# Altium schematic sheet MSP-EXP430F5529LP_3.SchDoc: MSP-EXP430F5529LP
size 286 x 199 mm; Date: 2015/6/22 13:08:34; SheetNumber: 4; Origin: Eagle; GateName_1: G$1; SymbolName_1: DINA4_L; LibraryName: MSP-EXP430F5659; DeviceSetName: DINA4_L; GateName_2: G$2; SymbolName_2: DOCFIELD; Sheet: Sheet:; REV: REV:
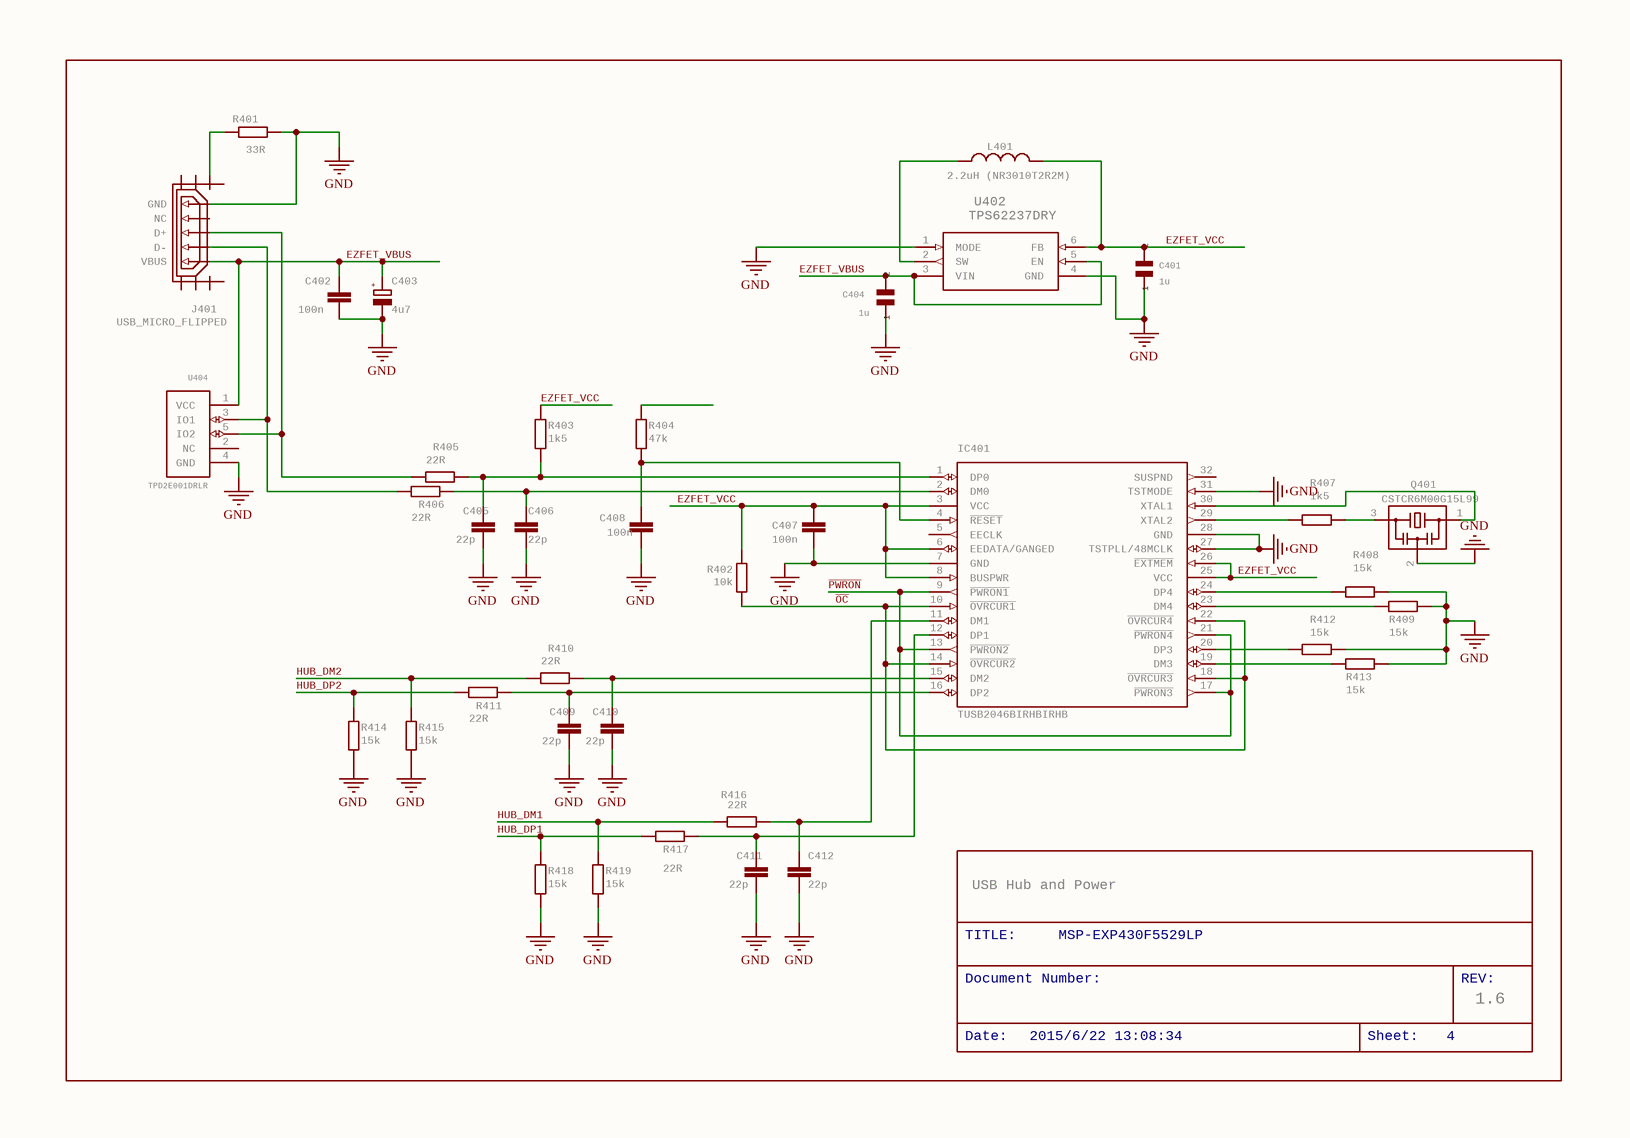
[diagram p0: MSP-EXP430F5529LP_3.SchDoc]

## Parts
C401  1u  [CSMD0805]
C402  100n  [0402]
C403  4u7  [A/3216-18R]
C404  1u  [CSMD0805]
C405  22p  [0402]
C406  22p  [0402]
C407  100n  [0402]
C408  100n  [0402]
C409  22p  [0402]
C410  22p  [0402]
C411  22p  [0402]
C412  22p  [0402]
IC401  TUSB2046BIRHBIRHB  [RHB_S-PQFP-N32]
J401  USB_MICRO_FLIPPED  [HIROSE-ZX62R-B-5P]
L401  2.2uH (NR3010T2R2M)  [L-NR3010]
Q401  CSTCR6M00G15L99  [MURATA-FILTER_CSTCR]
R401  33R  [0402]
R402  10k  [0402]
R403  1k5  [0402]
R404  47k  [0402]
R405  22R  [0402]
R406  22R  [0402]
R407  1k5  [0402]
R408  15k  [0402]
R409  15k  [0402]
R410  22R  [0402]
R411  22R  [0402]
R412  15k  [0402]
R413  15k  [0402]
R414  15k  [0402]
R415  15k  [0402]
R416  22R  [0402]
R417  22R  [0402]
R418  15k  [0402]
R419  15k  [0402]
U402  TPS62237DRY  [DRY6]
U404  TPD2E001DRLR  [TPD2E001-DRL]

## Nets
GND: C401.1 C402.2 C403.- C404.1 C405.2 C406.2 C407.2 C408.2 C409.2 C410.2 C411.2 C412.2 IC401.7(GND) IC401.27(TSTPLL/48MCLK) IC401.28(GND) IC401.31(TSTMODE) J401.GND Q401.2 R401.2 R408.1 R409.1 R412.1 R413.1 R414.2 R415.2 R418.2 R419.2 U402.1(MODE) U402.4(GND) U404.4(GND)
EZFET_VBUS: C402.1 C403.+ C404.2 J401.VBUS U402.3(VIN) U402.5(EN) U404.1(VCC)
EZFET_VCC: C401.2 C407.1 IC401.3(VCC) IC401.6(EEDATA/GANGED) IC401.8(BUSPWR) IC401.25(VCC) IC401.26(~{EXTMEM}) L401.P$2 R402.1 R403.1 U402.6(FB)
HUB_DM1: R416.2 R419.1
HUB_DM2: R410.2 R415.1
HUB_DP1: R417.2 R418.1
HUB_DP2: R411.2 R414.1
~{OC}: IC401.10(~{OVRCUR1}) IC401.14(~{OVRCUR2}) IC401.18(~{OVRCUR3}) IC401.22(~{OVRCUR4}) R402.2
~{PWRON}: IC401.9(~{PWRON1}) IC401.13(~{PWRON2}) IC401.17(~{PWRON3}) IC401.21(~{PWRON4})
NetC405_1: C405.1 IC401.1(DP0) R403.2 R405.1
NetC406_1: C406.1 IC401.2(DM0) R406.1
NetC408_1: C408.1 IC401.4(~{RESET}) R404.2
NetC409_1: C409.1 IC401.16(DP2) R411.1
NetC410_1: C410.1 IC401.15(DM2) R410.1
NetC411_1: C411.1 IC401.12(DP1) R417.1
NetC412_1: C412.1 IC401.11(DM1) R416.1
NetIC401_19: IC401.19(DM3) R413.2
NetIC401_20: IC401.20(DP3) R412.2
NetIC401_23: IC401.23(DM4) R409.2
NetIC401_24: IC401.24(DP4) R408.2
NetIC401_29: IC401.29(XTAL2) R407.2
NetIC401_30: IC401.30(XTAL1) Q401.1
NetJ401_D+: J401.D+ R405.2 U404.5(IO2)
NetJ401_D-: J401.D- R406.2 U404.3(IO1)
NetJ401_SHIELD1: J401.SHIELD1 R401.1
NetL401_P$1: L401.P$1 U402.2(SW)
NetQ401_3: Q401.3 R407.1

Not connected (* = marked no-connect by the designer): IC401 5(EECLK) 32(SUSPND); J401 NC SHIELD2 SHIELD3 SHIELD4 SHIELD5 SHIELD6; R404 1; U404 2(NC)

## Notes on the sheet
- TITLE:
- USB Hub and Power
- MSP-EXP430F5529LP
- Document Number:
- REV:
- 1.6
- Date:
- 2015/6/22 13:08:34
- Sheet:
- 4

## Library data of the parts
C401 C404 = CSMD0805: GateName_1: G$2; SymbolName_1: C; LibraryName: CAP; DeviceSetName: CSMD0805; 1: 1; 2: 2
C402 C405-C412 = C-EUCM0402: CAPACITOR, European symbol; GateName_1: G$1; SymbolName_1: C-EU; DeviceName: CM0402; LibraryName: rcl; DeviceSetName: C-EU
C403 = CPOL-EUA/3216-18R: POLARIZED CAPACITOR, European symbol; GateName_1: G$1; SymbolName_1: CPOL; DeviceName: A/3216-18R; LibraryName: rcl; DeviceSetName: CPOL-EU; +: +
IC401 = TUSB2046BIRHBIRHB: 4-PORT HUB FOR THE UNIVERSAL SERIAL BUS WITH OPTIONAL SERIAL EEPROM INTERFACE   Source: http://focus.ti.com/lit/ds/symlink/tusb2046b.pdf; MPN: TUSB2046BIRHBT; GateName_1: G$1; DeviceName: IRHB; SymbolName_1: TUSB2046B; LibraryName: texas; DeviceSetName: TUSB2046BIRHB; MF: MF; OC_FARNELL: 1610201; OC_NEWARK: 14N8499
J401 = USB_MICRO_FLIPPED: GateName_1: G$1; SymbolName_1: MICRO_USB_6_SHIELD; LibraryName: usb_con-update; DeviceSetName: USB_MICRO_FLIPPED
L401 = L-NR3010: GateName_1: G$1; SymbolName_1: L-US; LibraryName: MSP-EXP430F5659; DeviceSetName: L-NR3010
Q401 = MURATA-FILTER_CSTCR: Resonator   Source: murata.co.jp; MPN: CSTCR6M00G53-R0; GateName_1: G$1; SymbolName_1: MURATA-FILTER_CST; LibraryName: murata; DeviceSetName: MURATA-FILTER_CSTCR; MF: MF; OC_FARNELL: 1170434; OC_NEWARK: 25M8759
R401-R419 = R-EU_RM0402: RESISTOR, European symbol; GateName_1: G$1; SymbolName_1: R-EU; DeviceName: RM0402; DeviceSetName: R-EU_; LibraryName: rcl
U402 = TPS6223X_DRY_6: GENERIC_PART_NUMBER: TPS62231; MANUFACTURER: Texas Instruments; MANUFACTURER_PART_NUMBER: tps62231_dry_6; GateName_1: >NAME; DESCRIPTION: 3 MHz Ultra Small Step Down Converter in 1x1.5 SON Package; FAMILY_NAME: STEP-DOWN REGULATOR; INDUSTRY_STD_PKG_TYPE: SON; PACKAGE_DESIGNATOR: DRY; PIN_COUNT: 6; VENDOR: Texas Instuments; SymbolName_1: TPS6223X_DRY_6; LibraryName: tps62231dry; DeviceSetName: TPS6223X_DRY_6; DATASHEETURL: http://www.ti.com/lit/gpn/TPS62231
U404 = TPD2E001: TPD2E001 ESD-protection diode array; GateName_1: A; SymbolName_1: TPD2E001; LibraryName: Project7264; DeviceSetName: TPD2E001